# Altium schematic sheet AuxConnector.SchDoc
size 431 x 279 mm; SheetNumber: 7; SheetTotal: 8
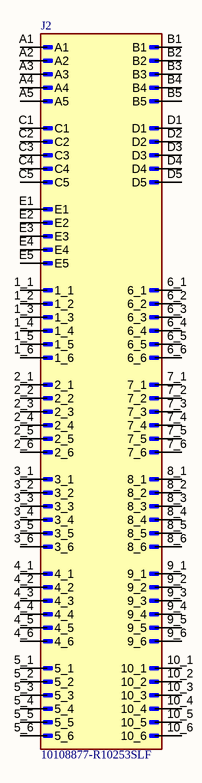
[diagram p0: AuxConnector.SchDoc]

## Parts
J2  10108877-R10253SLF  [AMPHENOL_10108877-R10253SLF]

## Nets

Not connected (* = marked no-connect by the designer): J2 1_1 1_2 1_3 1_4 1_5 1_6 2_1 2_2 2_3 2_4 2_5 2_6 3_1 3_2 3_3 3_4 3_5 3_6 4_1 4_2 4_3 4_4 4_5 4_6 5_1 5_2 5_3 5_4 5_5 5_6 6_1 6_2 6_3 6_4 6_5 6_6 7_1 7_2 7_3 7_4 7_5 7_6 8_1 8_2 8_3 8_4 8_5 8_6 9_1 9_2 9_3 9_4 9_5 9_6 10_1 10_2 10_3 10_4 10_5 10_6 A1 A2 A3 A4 A5 B1 B2 B3 B4 B5 C1 C2 C3 C4 C5 D1 D2 D3 D4 D5 E1 E2 E3 E4 E5

## Notes on the sheet
- DWG. NO.
- REV.
- SHT.
- THIS DOCUMENT AND THE DATA DISCLOSED HEREIN OR HEREWITH IS THE PROPERTY OF ALTIUM LIMITED AND MAY BE FREELY DISTRIBUTED IN WHOLE. NO RIGHTS ARE RESERVED OR EXPRESS OR IMPLIED WARANTEE GIVEN.
- REVISION
- DESCRIPTION
- DATE
- APPROVED
- TITLE
- PROJECT
- SCALE:
- B
- SIZE
- CAGE CODE
- FILE NAME
- DWG by:
- Heitor Sampaio Mendes
- SHEET
- OF
- REV

## Library data of the parts
J2 = 10108877-R10253SLF: MF: {'manufacturer': u'FCI'}; Package: None; Price: None; Value: *; MP: 10108877-R10253SLF; Availability: Unavailable